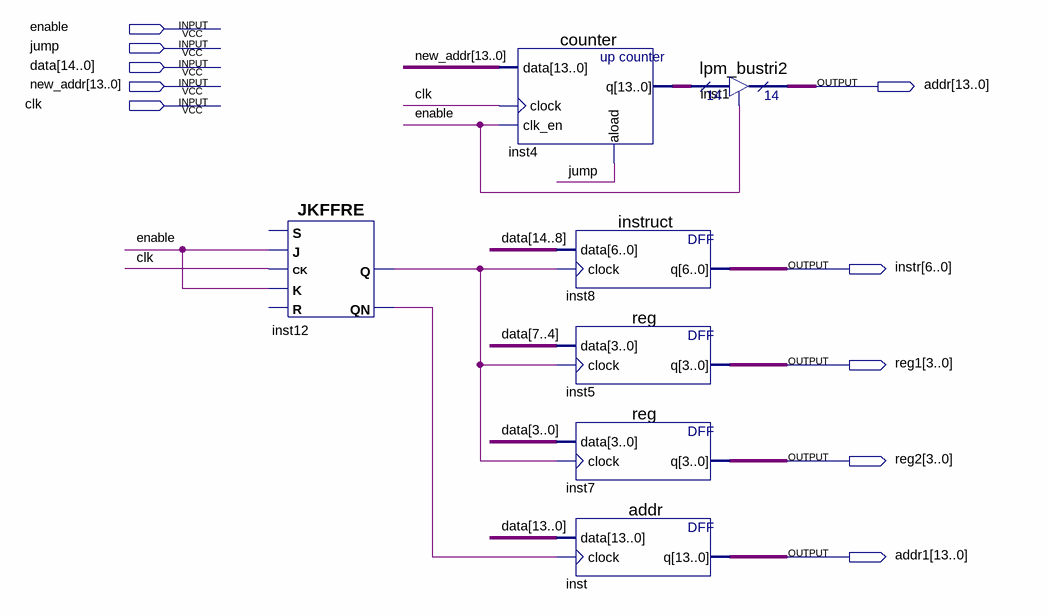
[diagram p0: schematic sheet]
// Quartus schematic ComRetr.bdf as structural Verilog: 7 symbols, 10 pins
module ComRetr (
  input  enable,
  input  jump,
  input  [14:0] data,
  input  [13:0] new_addr,
  input  clk,
  output [13:0] addr,
  output [6:0] instr,
  output [3:0] reg1,
  output [3:0] reg2,
  output [13:0] addr1
);

  wire inst12_q, inst12_qn;
  wire [13:0] inst4_q;

  JKFFRE inst12 (.K(enable), .CK(clk), .J(enable), .QN(inst12_qn), .Q(inst12_q));  // open: R, S
  counter inst4 (.data(new_addr), .clock(clk), .clk_en(enable), .aload(jump), .q(inst4_q));
  instruct inst8 (.data(data[14:8]), .clock(inst12_q), .q(instr));
  \reg  inst5 (.data(data[7:4]), .clock(inst12_q), .q(reg1));
  \reg  inst7 (.data(data[3:0]), .clock(inst12_q), .q(reg2));
  addr inst (.data(data[13:0]), .clock(inst12_qn), .q(addr1));
  lpm_bustri2 inst1 (.enabledt(enable), .data(inst4_q), .tridata(addr));
endmodule
